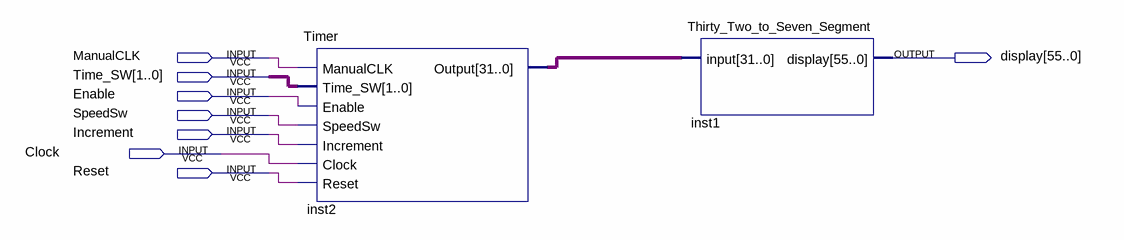
[diagram p0: schematic sheet]
// Quartus schematic FullMilitary.bdf as structural Verilog: 2 symbols, 8 pins
module FullMilitary (
  input  ManualCLK,
  input  [1:0] Time_SW,
  input  Enable,
  input  SpeedSw,
  input  Increment,
  input  Clock,
  input  Reset,
  output [55:0] display
);

  wire [31:0] inst2_output;

  Timer inst2 (
    .ManualCLK(ManualCLK), .Time_SW(Time_SW), .Enable(Enable), .SpeedSw(SpeedSw), .Increment(Increment),
    .Clock(Clock), .Reset(Reset), .Output(inst2_output));
  Thirty_Two_to_Seven_Segment inst1 (.\input (inst2_output), .display(display));
endmodule
